# Altium schematic sheet Clock_module.SchDoc
size A4; SheetNumber: 2; SheetTotal: 9
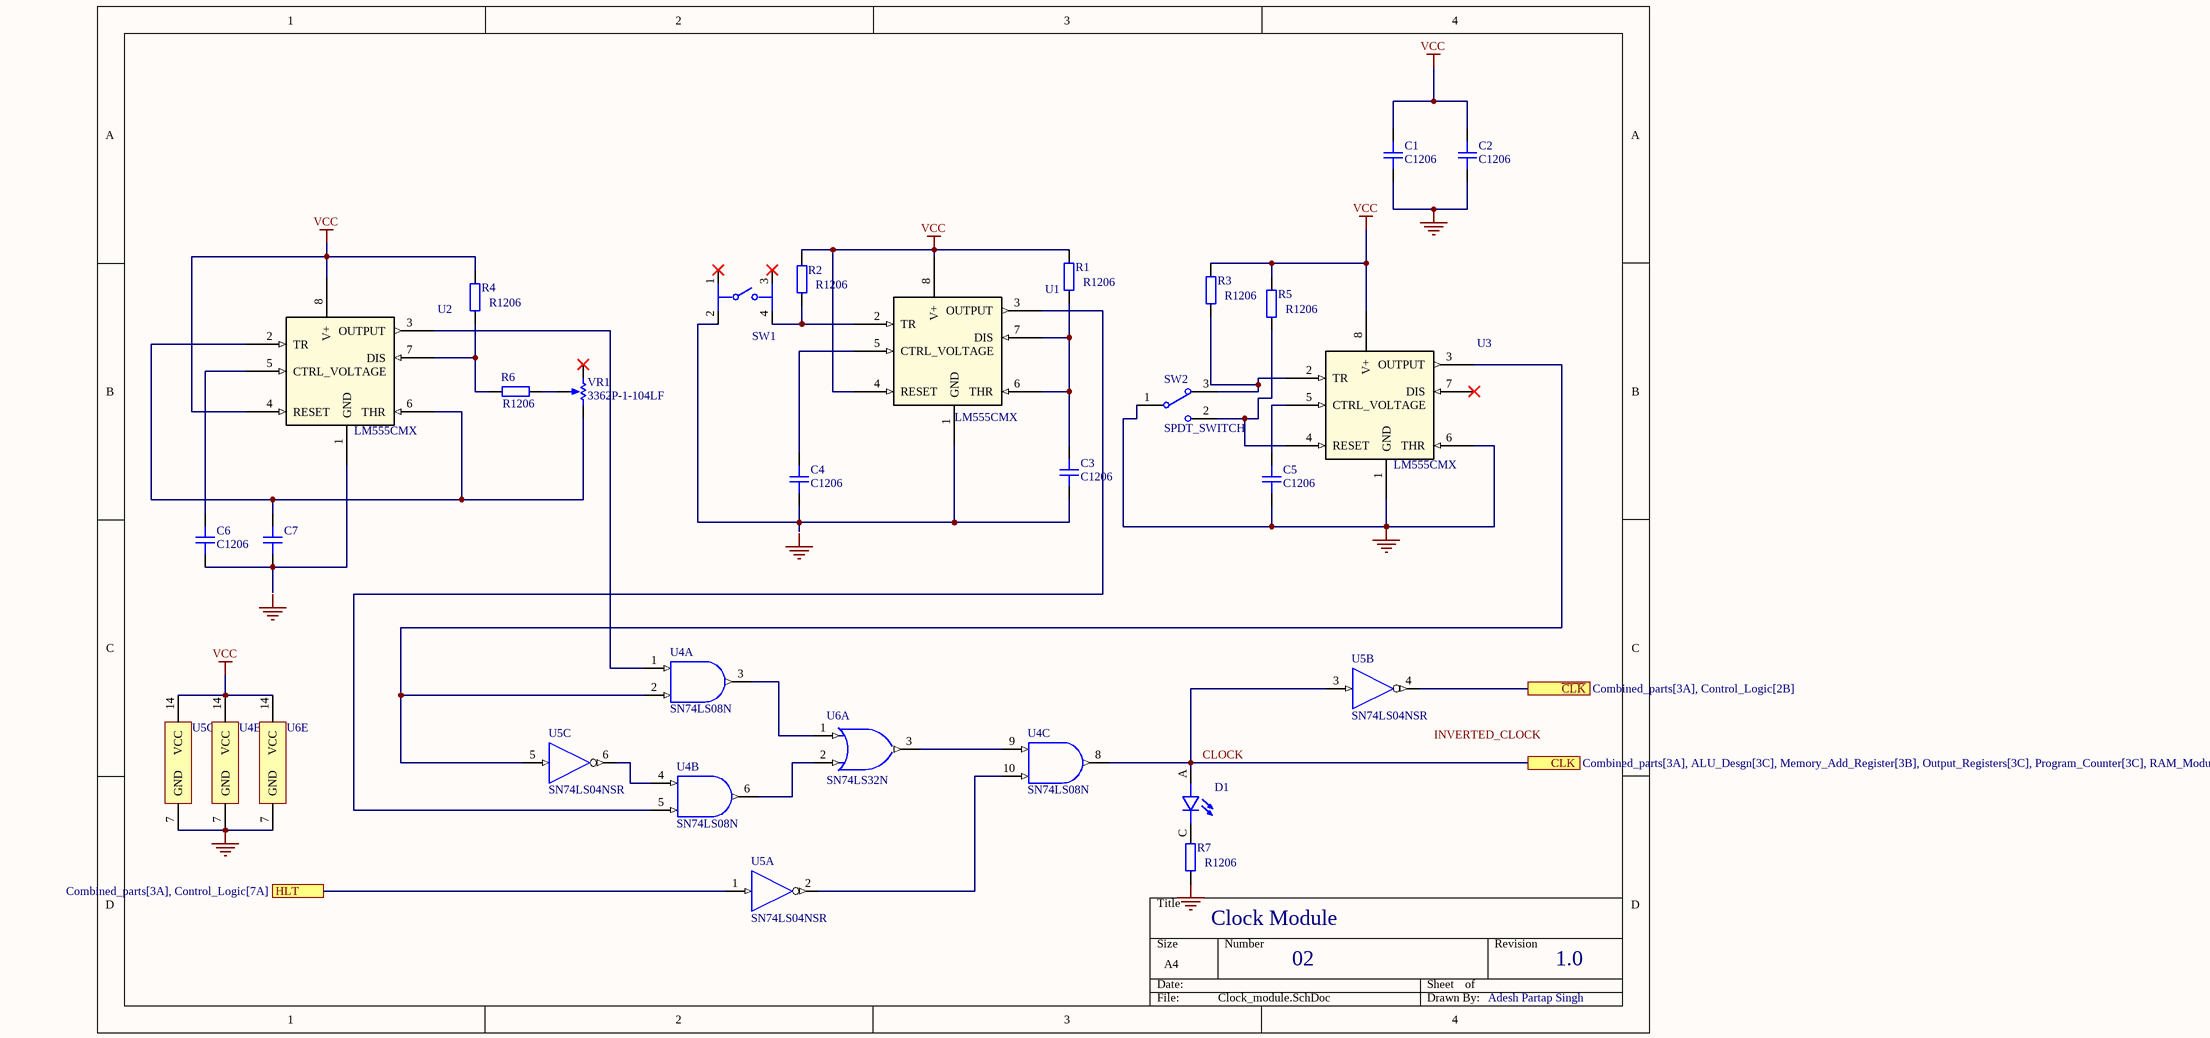
[diagram p0: Clock_module.SchDoc]

## Parts
C1  C1206  [CAP_1206]
C2  C1206  [CAP_1206]
C3  C1206  [CAP_1206]
C4  C1206  [CAP_1206]
C5  C1206  [CAP_1206]
C6  C1206  [CAP_1206]
C7  CAP_EL_NP_5MM  [CAP-EL-NP-5MM]  (value not drawn)
D1  L08R5000Q1  [LEDRD254W57D500H1070]  (value not drawn)
R1  R1206  [RES_1206]
R2  R1206  [RES_1206]
R3  R1206  [RES_1206]
R4  R1206  [RES_1206]
R5  R1206  [RES_1206]
R6  R1206  [RES_1206]
R7  R1206  [RES_1206]
SW1  3-1825910-1  [FP-3-1825910-1-MFG]  (value not drawn)
SW2  SPDT_SWITCH  [EOZ-09.03201.02-3]
U1  LM555CMX  [SOIC-8_ONS]
U2  LM555CMX  [SOIC-8_ONS]
U3  LM555CMX  [SOIC-8_ONS]
U4  SN74LS08N  [N0014A]  (parts A,B,C,E of 5)
U5  SN74LS04NSR  [NS0014A_M]  (parts A,B,C,G of 7)
U6  SN74LS32N  [OR_GATE_PCB]  (parts A,E of 5)
VR1  3362P-1-104LF  [BOUR-3362P]

## Ports
CLK (see Combined_parts[3A], ALU_Desgn[3C], Memory_Add_Register[3B], Output_Registers[3C], Program_Counter[3C], RAM_Module[4D], Registers_Module[2A], Registers_Module[8A], Registers_Module[8C]), HLT (see Combined_parts[3A], Control_Logic[7A]), ~{CLK} (see Combined_parts[3A], Control_Logic[2B])

## Nets
GND: C1.1 C2.1 C5.1 R7.1 SW2.1 U3.1(GND) U3.6(THR) U4.7(GND) U5.7(GND) U6.7(GND)
VCC: C1.2 C2.2 R1.2 R2.2 R3.2 R4.2 R5.2 U1.4(RESET) U1.8(V+) U2.4(RESET) U2.8(V+) U3.8(V+) U4.14(VCC) U5.14(VCC) U6.14(VCC)
~{CLK}: U5.4(~{2Y}) ; port ~{CLK}
CLOCK: D1.A U4.8(3Y) U5.3(2A) ; port CLK
HLT: U5.1(1A) ; port HLT
NetC3_1: C3.1 C4.1 SW1.2 U1.1(GND)
NetC3_2: C3.2 R1.1 U1.6(THR) U1.7(DIS)
NetC4_2: C4.2 U1.5(CTRL_VOLTAGE)
NetC5_2: C5.2 U3.5(CTRL_VOLTAGE)
NetC6_1: C6.1 C7.1 U2.1(GND)
NetC6_2: C6.2 U2.5(CTRL_VOLTAGE)
NetC7_2: C7.2 U2.2(TR) U2.6(THR) VR1.3(CW)
NetR2_1: R2.1 SW1.4 U1.2(TR)
NetR3_1: R3.1 SW2.3 U3.2(TR)
NetR4_1: R4.1 R6.1 U2.7(DIS)
NetR5_1: R5.1 SW2.2 U3.4(RESET)
NetR6_2: R6.2 VR1.2(S)
NetU1_3: U1.3(OUTPUT) U4.5(2B)
NetU2_3: U2.3(OUTPUT) U4.1(1A)
NetU3_3: U3.3(OUTPUT) U4.2(1B) U5.5(3A)
NetU4_3: U4.3(1Y) U6.1(1A)
NetU4_4: U4.4(2A) U5.6(~{3Y})
NetU4_6: U4.6(2Y) U6.2(1B)
NetU4_9: U4.9(3A) U6.3(1Y)
NetU4_10: U4.10(3B) U5.2(~{1Y})

Not connected (* = marked no-connect by the designer): D1 C; R7 2; SW1 1* 3*; U3 7(DIS)*; VR1 1(CCW)*

## Notes on the sheet
- (near R7) Clock Module
- 02
- 1.0
- Adesh Partap Singh
- Labels drawn without touching a wire or pin: GND, INVERTED_CLOCK

## Library data of the parts
C1-C6 = CAP_1206: Capacitor SMD 1206; Manufacturer: *; Manufacturer Part Number: *; Distributor Link: *; LCSC: *; Rating: *; Dielectric: *
C7 = CAP_EL_NP_5MM: Capacitor SMD Electrolytic Non-Polarised 5mm Diameter; Manufacturer: Nichicon; Manufacturer Part Number: *
D1 = L08R5000Q1: LED, 5MM, ORANGE; LED / Lamp Size: 5mm / T-1 3/4; LED Colour: Orange; Typ Luminous Intensity: 4.3mcd; Viewing Angle: ...; MF: LED Technology; Value: *; SnapEDA_Link: https://www.snapeda.com/parts/L08R5000Q1/LED+Technology/view-part/?ref=snap; MP: L08R5000Q1; Check_prices: https://www.snapeda.com/parts/L08R5000Q1/LED+Technology/view-part/?ref=eda; Availability: In Stock; Price: None; Package: None
R1-R7 = RES_1206: Resistor SMD 1206; Manufacturer: *; Manufacturer Part Number: *; Distributor Link: *; LCSC: *
SW1 = CMP-03407-000001-1: SWITCH TACTILE SPST-NO 0.05A 24V; Manufacturer: TE Connectivity; Operating Force: 160gf; Contact Current Rating: 50mA; Contact Resistance: 100mΩ; Electromechanical Life: 100000Cycles; Device Class L1: Electromechanical; ComponentLink2URL: https://www.te.com/commerce/DocumentDelivery/DDEController?Action=srchrtrv&DocNm=1825910&DocType=Customer+Drawing&DocLang=English; Category: Switch; Device Class L2: Switches; Temperature: -35°C to +85°C; RoHS: TRUE; Mount: Through Hole; Manufacturer Part Number: 3-1825910-1; Automotive: No; Lead Free: Yes; Device Class L3: Tactile Switches; ComponentLink2Description: Datasheet; Temperature Range High: +85°C; Height: 17.3mm; Package: 0; Temperature Range Low: -35°C; Throw Configuration: SPST-NO; Digikey Description: SWITCH TACTILE SPST-NO 0.05A 24V; Octopart: https://octopart.com/3-1825910-1-te+connectivity-46506874
SW2 = SWITCH_SPDT
U1-U3 = LM555CMX: No Description Available; Mfr_Name: onsemi; Copyright: Copyright (C) 2023 Ultra Librarian. All rights reserved.; Manufacturer_Part_Number: LM555CMX; RefDes: RefDes; Type: DEV
U4 = CMP-0777-00259-3: Quadruple 2-Input Positive-AND Gates, N0014A, TUBE; Manufacturer: Texas Instruments; VCC(Max)(V): 5.25; ICC @ Nom Voltage(Max)(mA): 0.021; VCC(Min)(V): 4.75; tpd @ Nom Voltage(Max)(ns): 25; Rating: Catalog; Output Type: TTL; Bits(#): 4; Schmitt Trigger: No; Voltage(Nom)(V): 5; Technology Family: LS; F @ Nom Voltage(Max)(Mhz): 35; Output Drive (IOL/IOH)(Max)(mA): -0.8/16; PackageReference: N0014A; DatasheetVersion: SDLS033; Input Type: TTL; Operating Temperature Range(C): 0 to 70; Generic Part Number: SN74LS08
U5 = CMP-1615-00958-3: Hex inverters, NS0014A, LARGE T&R; Manufacturer: Texas Instruments; VCC(Min)(V): 4.75; ICC @ Nom Voltage(Max)(mA): 0.033; tpd @ Nom Voltage(Max)(ns): 22; Rating: Catalog; F @ Nom Voltage(Max)(Mhz): 35; Voltage(Nom)(V): 5; VCC(Max)(V): 5.25; Output Drive (IOL/IOH)(Max)(mA): -0.4/8; Output Type: CMOS; Schmitt Trigger: No; Input Type: TTL; Technology Family: LS; Bits(#): 6; Operating Temperature Range(C): 0 to 70; DatasheetVersion: SDLS029C; Generic Part Number: SN74LS04; PackageReference: NS0014A
U6 = CMP-1573-00145-3_1: Quad 2-input positive-OR gates, N0014A, TUBE; Manufacturer: Texas Instruments; tpd @ Nom Voltage(Max)(ns): 22; Output Drive (IOL/IOH)(Max)(mA): 0.8/-16; Input Type: TTL; VCC(Min)(V): 4.75; F @ Nom Voltage(Max)(Mhz): 35; Voltage(Nom)(V): 5; ICC @ Nom Voltage(Max)(mA): 0.038; VCC(Max)(V): 5.25; Rating: Catalog; Bits(#): 4; Generic Part Number: SN74LS32; DatasheetVersion: SDLS100; Operating Temperature Range(C): 0 to 70; Output Type: TTL; Code_JEDEC: MS-001; PackageVersion: http://www.ti.com/lit/ml/mpdi002c/mpdi002c.pdf; PackageReference: N0014A
VR1 = CMP-1747-00003-1: Square Trimpot(R) Trimming Potentiometer, 100 KOhm, 300 V, -55 to 125 degC, 3-Pin THD, RoHS, Tube; Voltage Rating: 250 V; Case\Package: Axial; Tolerance: 1%; Power Rating: 250 mW; Resistance: 1 mohm; RoHSCompliant: true; ComponentLink2URL: http://www.bourns.com/docs/Product-Datasheets/3362.pdf; ComponentLink1Description: Manufacturer URL; DatasheetVersion: May-16; Package Quantity: 200; ComponentLink2Description: Datasheet; Min Operating Temperature: -55 degC; Mount: Through Hole; PackageDescription: 3-Pin Through Hole Device, Body 6.6 x 6.99 mm, Pitch 2.54 mm; Length: 0.248 inch; ComponentLink1URL: http://www.bourns.com/; PackageReference: 3326P; Max Operating Temperature: 155 degC; Packaging: Bulk